# EAGLE schematic custom_band_pass_filter_calc (EAGLE 9.6.2)
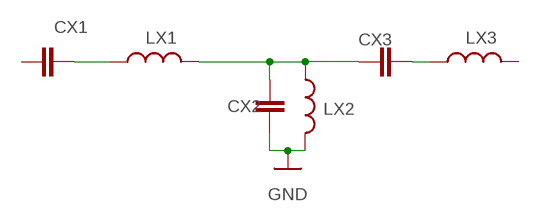
[diagram p0: schematic, sheet 1]

## Parts
CX1  C2,5-3  [C2.5-3]
CX2  C2,5-3  [C2.5-3]
CX3  C2,5-3  [C2.5-3]
LX1  L  (no package)
LX2  L  (no package)
LX3  L  (no package)

## Nets
GND: CX2.2 LX2.2
N$3: CX2.1 CX3.1 LX1.2 LX2.1
N$9: CX1.2 LX1.1
N$11: CX3.2 LX3.1
Unconnected: CX1.1 LX3.2

## Library data of the parts
CX1-CX3 = capacitor-wima:C: CAPACITOR naming: grid - package width
LX1-LX3 = ngspice-simulation:L: INDUCTOR